# Altium schematic sheet Energy Inpıts.SchDoc: Energy Inputs
size 292 x 193 mm; SheetNumber: 13; SheetTotal: 16
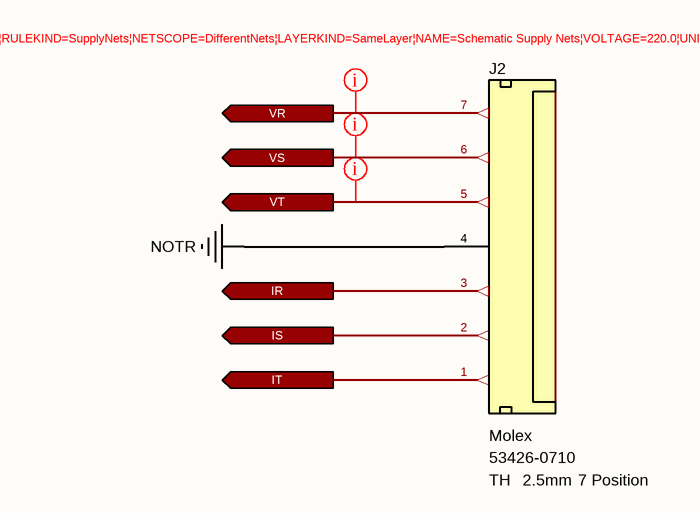
[diagram p0: Energy Inpıts.SchDoc]

## Parts
J2  Manufacturer Name: Molex  Case: TH  Pitch: 2.5mm  Position: 7 Position  [Connector 7P (2.54)]  (hidden comment: 53426-0710)

## Ports
IR (out), IS (out), IT (out), VR (out), VS (out), VT (out)

## Nets
NOTR: J2.4(Pin-4)
IR: J2.3(Pin-3) ; port IR
IS: J2.2(Pin-2) ; port IS
IT: J2.1(Pin-1) ; port IT
VR: J2.7(Pin-7) ; port VR
VS: J2.6(Pin-6) ; port VS
VT: J2.5(Pin-5) ; port VT

## Layout directives
rule Supply Nets [Voltage = 220.0]; net class HV: VR, VS, VT

## Notes on the sheet
- © 2021 All rights reserved.
  This document may not, in whole or in part, be copied, photocopied, reproduced, translated or converted to any electronic or machine readable from without prior written permission of Mehmet Günce Akkoyun.
  Engineer contact : akkoyun@me.com
- Property of
- Engineer :
- Date :
- Size :
- A4
- Time :
- Project :
- Page :
- /
- Customer :
- Product ID :
- Module ID :
- Version :
- File :
- Revision :

## Library data of the parts
J2 = Connector - Tunic 7P (2.5): 2.50mm Pitch Mini-Lock Wire-to-Board Header Right Angle Friction and Positive Lock 7 Circuits; System: Connector; Manufacturer Part Number: 53426-0710